# Altium schematic sheet 01-POWER.SchDoc
size C
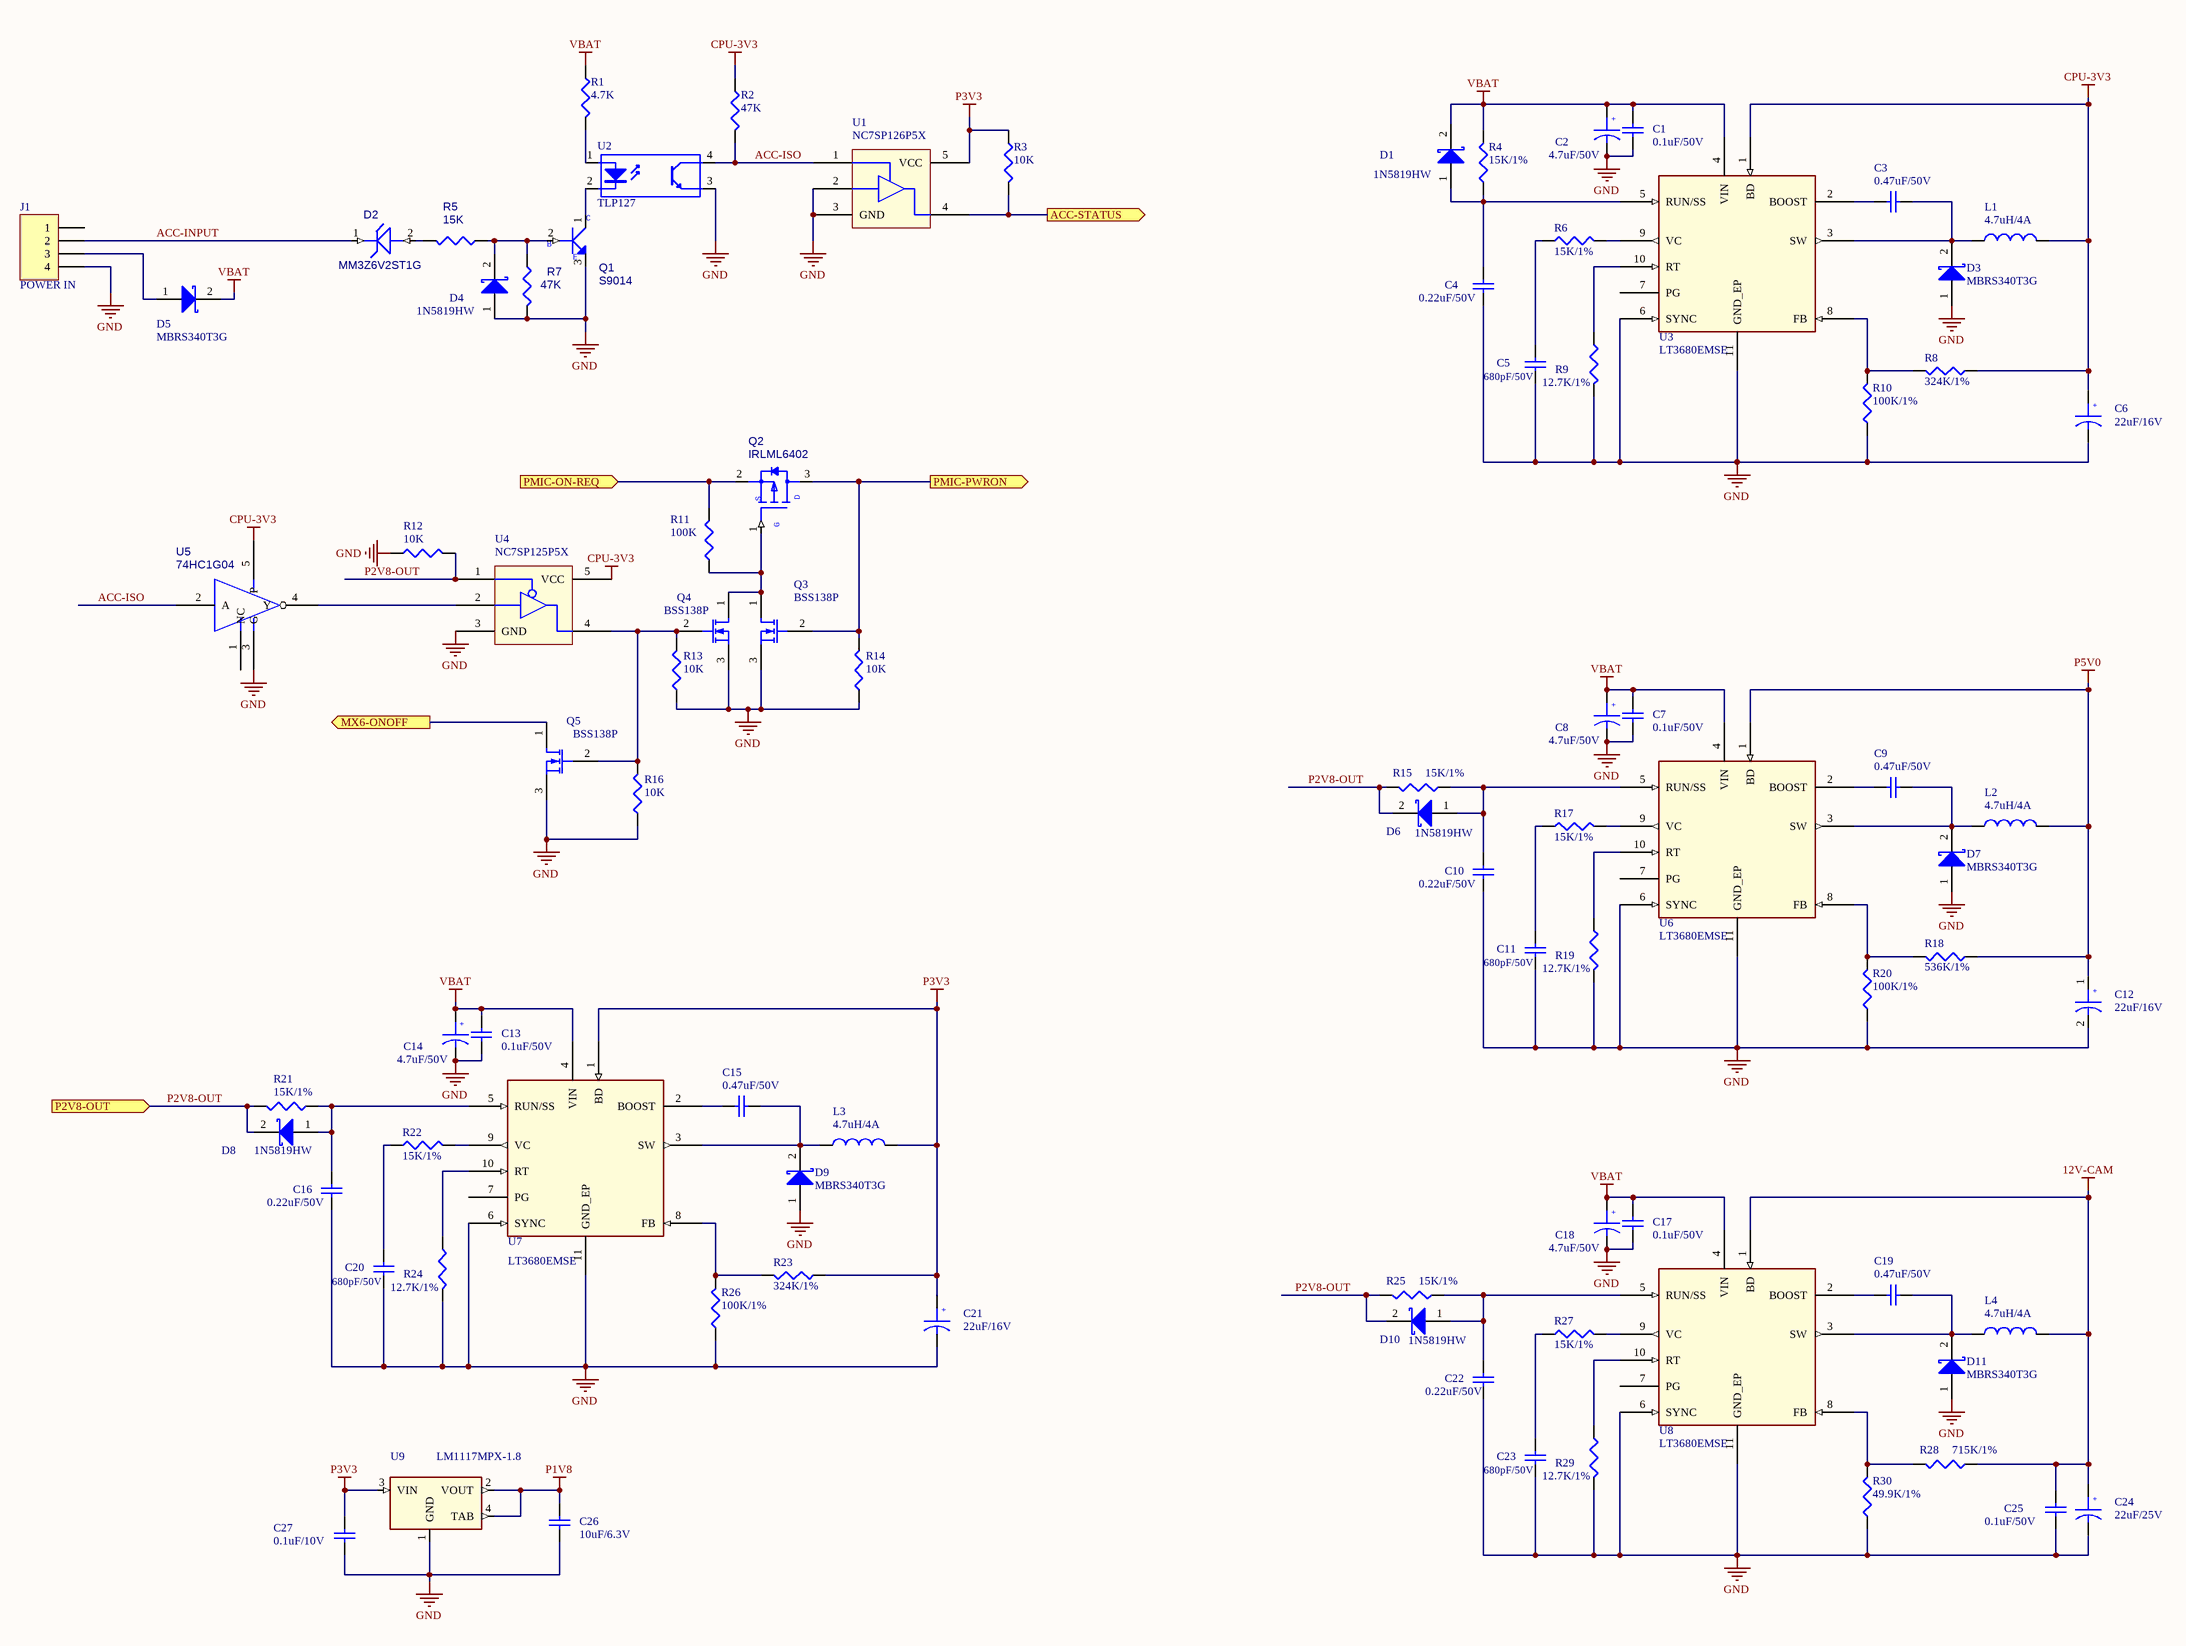
[diagram p0: 01-POWER.SchDoc]

## Parts
C1  0.1uF/50V  [0603]
C2  4.7uF/50V  [DL-5X5.4]
C3  0.47uF/50V  [0603]
C4  0.22uF/50V  [0603]
C5  680pF/50V  [0402]
C6  22uF/16V  [3528]
C7  0.1uF/50V  [0603]
C8  4.7uF/50V  [DL-5X5.4]
C9  0.47uF/50V  [0603]
C10  0.22uF/50V  [0603]
C11  680pF/50V  [0402]
C12  22uF/16V  [3528]
C13  0.1uF/50V  [0603]
C14  4.7uF/50V  [DL-5X5.4]
C15  0.47uF/50V  [0603]
C16  0.22uF/50V  [0603]
C17  0.1uF/50V  [0603]
C18  4.7uF/50V  [DL-5X5.4]
C19  0.47uF/50V  [0603]
C20  680pF/50V  [0402]
C21  22uF/16V  [3528]
C22  0.22uF/50V  [0603]
C23  680pF/50V  [0402]
C24  22uF/25V  [DL-5X5.4]
C25  0.1uF/50V  [0603]
C26  10uF/6.3V  [0805]
C27  0.1uF/10V  [0402]
D1  1N5819HW  [1N5819]
D2  MM3Z6V2ST1G  [SOD323F]
D3  MBRS340T3G  [SMC]
D4  1N5819HW  [1N5819]
D5  MBRS340T3G  [SMC]
D6  1N5819HW  [1N5819]
D7  MBRS340T3G  [SMC]
D8  1N5819HW  [1N5819]
D9  MBRS340T3G  [SMC]
D10  1N5819HW  [1N5819]
D11  MBRS340T3G  [SMC]
J1  POWER IN  [3030WV-F-2*2P]
L1  4.7uH/4A  [IND-10UH-1.5A]
L2  4.7uH/4A  [IND-10UH-1.5A]
L3  4.7uH/4A  [IND-10UH-1.5A]
L4  4.7uH/4A  [IND-10UH-1.5A]
Q1  S9014  [NPN]
Q2  IRLML6402  [MOSFET]
Q3  BSS138P  [NPN]
Q4  BSS138P  [NPN]
Q5  BSS138P  [NPN]
R1  4.7K  [0402]
R2  47K  [0402]
R3  10K  [0402]
R4  15K/1%  [0402]
R5  15K  [0402]
R6  15K/1%  [0402]
R7  47K  [0402]
R8  324K/1%  [0402]
R9  12.7K/1%  [0402]
R10  100K/1%  [0402]
R11  100K  [0402]
R12  10K  [0402]
R13  10K  [0402]
R14  10K  [0402]
R15  15K/1%  [0402]
R16  10K  [0402]
R17  15K/1%  [0402]
R18  536K/1%  [0402]
R19  12.7K/1%  [0402]
R20  100K/1%  [0402]
R21  15K/1%  [0402]
R22  15K/1%  [0402]
R23  324K/1%  [0402]
R24  12.7K/1%  [0402]
R25  15K/1%  [0402]
R26  100K/1%  [0402]
R27  15K/1%  [0402]
R28  715K/1%  [0402]
R29  12.7K/1%  [0402]
R30  49.9K/1%  [0402]
U1  NC7SP126P5X  [SC70]
U2  TLP127  [TLP127]
U3  LT3680EMSE  [MSOP10]
U4  NC7SP125P5X  [SC70]
U5  74HC1G04  [SOT753]
U6  LT3680EMSE  [MSOP10]
U7  LT3680EMSE  [MSOP10]
U8  LT3680EMSE  [MSOP10]
U9  LM1117MPX-1.8  [AMS1117]

## Ports
ACC-STATUS (out), MX6-ONOFF (out), P2V8-OUT (in), PMIC-ON-REQ (in), PMIC-PWRON (out)

## Nets
12V-CAM: C24.1 C25.1 L4.2 R28.1 U8.1(BD)
CPU-3V3: C6.1 L1.2 R2.1 R8.1 U3.1(BD) U4.5(VCC) U5.5(P)
GND: C1.2 C2.2 C4.2 C5.2 C6.2 C7.2 C8.2 C10.2 C11.2 C12.2 C13.2 C14.2 C16.2 C17.2 C18.2 C20.2 C21.2 C22.2 C23.2 C24.2 C25.2 C26.2 C27.2 D3.1(A) D4.1(A) D7.1(A) D9.1(A) D11.1(A) J1.4 Q1.3(EMITTER) Q3.3(S) Q4.3(S) Q5.3(S) R7.2 R9.2 R10.1 R12.2 R13.2 R14.2 R16.2 R19.2 R20.1 R24.2 R26.1 R29.2 R30.1 U1.2(A) U1.3(GND) U2.3(E) U3.6(SYNC) U3.11(GND_EP) U4.3(GND) U5.3(G) U6.6(SYNC) U6.11(GND_EP) U7.6(SYNC) U7.11(GND_EP) U8.6(SYNC) U8.11(GND_EP) U9.1(GND)
P1V8: C26.1 U9.2(VOUT) U9.4(TAB)
P3V3: C21.1 C27.1 L3.2 R3.1 R23.1 U1.5(VCC) U7.1(BD) U9.3(VIN)
P5V0: C12.1 L2.2 R18.1 U6.1(BD)
VBAT: C1.1 C2.1 C7.1 C8.1 C13.1 C14.1 C17.1 C18.1 D1.2(K) D5.2(K) R1.1 R4.2 U3.4(VIN) U6.4(VIN) U7.4(VIN) U8.4(VIN)
ACC-INPUT: D2.1 J1.2
ACC-ISO: R2.2 U1.1(OE) U2.4(C) U5.2(A)
ACC-STATUS: R3.2 U1.4(Y) ; port ACC-STATUS
MX6-ONOFF: Q5.1(D) ; port MX6-ONOFF
P2V8-OUT: D6.2(K) D8.2(K) D10.2(K) R12.1 R15.2 R21.2 R25.2 U4.1(OE) ; port P2V8-OUT
PMIC-ON-REQ: Q2.2(S) R11.1 ; port PMIC-ON-REQ
PMIC-PWRON: Q2.3(D) Q3.2(G) R14.1 ; port PMIC-PWRON
NetC3_1: C3.1 D3.2(K) L1.1 U3.3(SW)
NetC3_2: C3.2 U3.2(BOOST)
NetC4_1: C4.1 D1.1(A) R4.1 U3.5(RUN/SS)
NetC5_1: C5.1 R6.1
NetC9_1: C9.1 D7.2(K) L2.1 U6.3(SW)
NetC9_2: C9.2 U6.2(BOOST)
NetC10_1: C10.1 D6.1(A) R15.1 U6.5(RUN/SS)
NetC11_1: C11.1 R17.1
NetC15_1: C15.1 D9.2(K) L3.1 U7.3(SW)
NetC15_2: C15.2 U7.2(BOOST)
NetC16_1: C16.1 D8.1(A) R21.1 U7.5(RUN/SS)
NetC19_1: C19.1 D11.2(K) L4.1 U8.3(SW)
NetC19_2: C19.2 U8.2(BOOST)
NetC20_1: C20.1 R22.1
NetC22_1: C22.1 D10.1(A) R25.1 U8.5(RUN/SS)
NetC23_1: C23.1 R27.1
NetD2_2: D2.2 R5.2
NetD4_2: D4.2(K) Q1.2(BASE) R5.1 R7.1
NetD5_1: D5.1(A) J1.3
NetQ1_1: Q1.1(COLLECTOR) U2.2(K)
NetQ2_1: Q2.1(G) Q3.1(D) Q4.1(D) R11.2
NetQ4_2: Q4.2(G) Q5.2(G) R13.1 R16.1 U4.4(Y)
NetR1_2: R1.2 U2.1(A)
NetR6_2: R6.2 U3.9(VC)
NetR8_2: R8.2 R10.2 U3.8(FB)
NetR9_1: R9.1 U3.10(RT)
NetR17_2: R17.2 U6.9(VC)
NetR18_2: R18.2 R20.2 U6.8(FB)
NetR19_1: R19.1 U6.10(RT)
NetR22_2: R22.2 U7.9(VC)
NetR23_2: R23.2 R26.2 U7.8(FB)
NetR24_1: R24.1 U7.10(RT)
NetR27_2: R27.2 U8.9(VC)
NetR28_2: R28.2 R30.2 U8.8(FB)
NetR29_1: R29.1 U8.10(RT)
NetU4_2: U4.2(A) U5.4(Y)

Not connected (* = marked no-connect by the designer): J1 1; U3 7(PG); U5 1(NC); U6 7(PG); U7 7(PG); U8 7(PG)

## Notes on the sheet
- (in symbol CAP WP) +
- (in symbol MMBT3904_NL_SOT23-3) C; B; E

## Library data of the parts
C1 C3-C5 C7 C9-C11 C13 C15-C17 C19 C20 C22 C23 C25-C27 = Cap: Capacitor; Published: 8-Jun-2000; LatestRevisionDate: 17-Jul-2002; LatestRevisionNote: Re-released for DXP Platform.; PackageReference: RAD-0.3; Publisher: Altium Limited; PackageDescription: Radial Cap, Thru-Hole; 2 Leads; 0.3 in Pin Spacing
C2 C6 C8 C12 C14 C18 C21 C24 = CAP WP
D1 D3-D11 = Diode 11DQ03: Schottky Rectifier
D2 = MMGZ5231BPTLL34
J1 = Header 4: Header, 4-Pin; LatestRevisionDate: 17-Jul-2002; LatestRevisionNote: Re-released for DXP Platform.; Publisher: Altium Limited
L1-L4 = INDUCTOR_A: IND CHK PWR 2.2UH@1MHZ 3.2A 20% SMT; CLASS: DISCRETE; AGILE_PN: 180-77679; MFG_NAME01: Murata; MFG_PN01: LQH55DN2R2M03L; CAD_APPROVED: Yes; Tolerance: 20%; ROHS: Yes; HEIGHT: 5.0 MM; PART_TYPE: INDUCTOR
Q1 = MMBT3904_NL_SOT23-3: Part Description: S TR MMBT3904_NL NPN SOT23; Part Number: SB039040000
Q2 = AO3401L_SOT23-3_0: Part Number: SB934010010; ROOM: USB POWER; Part Value: AO3401L_SOT23-3
Q3-Q5 = MOSFET-N: N-Channel MOSFET; Published: 8-Jun-2000; LatestRevisionDate: 17-Jul-2002; LatestRevisionNote: Re-released for DXP Platform.; PackageVersion: 1995/1996; PackageReference: E3; Publisher: Altium Limited; PackageDescription: TO, Flat Index; 3 In-Line, Axial Leads; Body Dia. 4.6mm; Lead Dia. 0.5 mm (max)
R1-R3 R12 = CR16-1003FM
R4 R6 R8-R10 R15 R17-R30 = Res3: Resistor; Published: 8-Jun-2000; LatestRevisionDate: 29-May-2009; LatestRevisionNote: IPC-7351 Footprint Added.; PackageReference: J1-0603; Publisher: Altium Limited; PackageDescription: Chip Resistor
R5 R7 = R
R11 R13 R14 R16 = Res3: Resistor; Value: 0.1/1W; Published: 8-Jun-2000; LatestRevisionDate: 29-May-2009; LatestRevisionNote: IPC-7351 Footprint Added.; PackageReference: J1-0603; Publisher: Altium Limited; PackageDescription: Chip Resistor
U2 = Optoisolator1: 4-Pin Phototransistor Optocoupler; Published: 24-Mar-1999; LatestRevisionDate: 04-Mar-2005; LatestRevisionNote: Sch pins 3 & 4 Swapped.; DatasheetVersion: Nov-2003; PackageReference: DIP-4; Publisher: Altium Limited
U3 U6-U8 = LT3680_MSOP_10P: IC VREG STEP DOWN SW 2.4MHZ 3.5A 0.79V-30V 3.6V-36V MSOP10; AGILE_PN: 315-79046; MFG_NAME01: Linear Technology; MFG_PN01: LT3680EMSE#PBF; CAD_APPROVED: Yes; CLASS: IC; ROHS: Yes; HEIGHT: 1.1MM
U5 = 74LVC1G04GW_SOT353-5: Part  Number: SA00000FX00
U9 = LD1117AS18: IC VREG LDO 1.8V 1A 10V SOT-223; CAD_APPROVED: Yes; MFG_PN01: LD1117AS18TR; MFG_NAME01: ST MICROELECTRONICS; AGILE_PN: 315-78911; CLASS: IC; HEIGHT: 1.9MM; ROHS: Yes